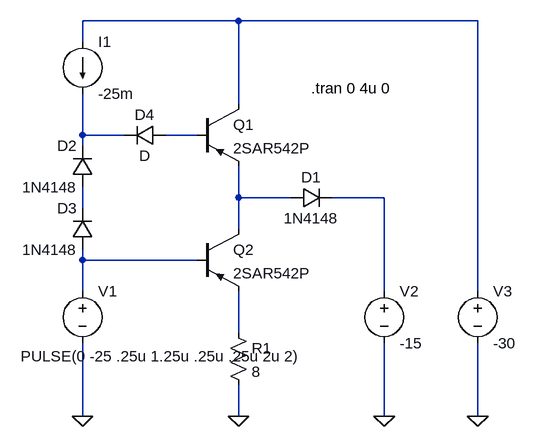
[diagram p0: schematic ClaseG_Basico_PNP.asc]
ClaseG_Basico_PNP.asc, the LTspice schematic file:
Version 4
SHEET 1 1020 680
WIRE 464 -48 224 -48
WIRE 832 -48 464 -48
WIRE 224 -16 224 -48
WIRE 464 80 464 -48
WIRE 224 128 224 64
WIRE 288 128 224 128
WIRE 400 128 352 128
WIRE 224 144 224 128
WIRE 464 224 464 176
WIRE 544 224 464 224
WIRE 688 224 608 224
WIRE 224 240 224 208
WIRE 464 272 464 224
WIRE 224 320 224 304
WIRE 400 320 224 320
WIRE 224 368 224 320
WIRE 688 368 688 224
WIRE 832 368 832 -48
WIRE 464 432 464 368
WIRE 224 560 224 448
WIRE 464 560 464 512
WIRE 688 560 688 448
WIRE 832 560 832 448
FLAG 464 560 0
FLAG 224 560 0
FLAG 688 560 0
FLAG 832 560 0
SYMBOL diode 544 240 R270
WINDOW 0 32 32 VTop 2
WINDOW 3 0 32 VBottom 2
SYMATTR InstName D1
SYMATTR Value 1N4148
SYMBOL voltage 224 352 R0
WINDOW 3 -95 116 Left 2
SYMATTR Value PULSE(0 -25 .25u 1.25u .25u .25u 2u 2)
SYMATTR InstName V1
SYMBOL voltage 688 352 R0
SYMATTR InstName V2
SYMATTR Value -15
SYMBOL voltage 832 352 R0
SYMATTR InstName V3
SYMATTR Value -30
SYMBOL res 448 416 R0
SYMATTR InstName R1
SYMATTR Value 8
SYMBOL current 224 -16 R0
SYMATTR InstName I1
SYMATTR Value -25m
SYMBOL diode 240 208 R180
WINDOW 0 24 64 Left 2
WINDOW 3 24 0 Left 2
SYMATTR InstName D2
SYMATTR Value 1N4148
SYMBOL diode 240 304 R180
WINDOW 0 24 64 Left 2
WINDOW 3 24 0 Left 2
SYMATTR InstName D3
SYMATTR Value 1N4148
SYMBOL diode 352 112 R90
WINDOW 0 0 32 VBottom 2
WINDOW 3 32 32 VTop 2
SYMATTR InstName D4
SYMBOL pnp 400 80 R0
SYMATTR InstName Q1
SYMATTR Value 2SAR542P
SYMBOL pnp 400 272 R0
SYMATTR InstName Q2
SYMATTR Value 2SAR542P
TEXT 576 56 Left 2 !.tran 0 4u 0

The netlist it stands for:
* ClaseG_Basico_PNP.asc
D1 N004 N005 1N4148
V1 N007 0 PULSE(0 -25 .25u 1.25u .25u .25u 2u 2)
V2 N005 0 -15
V3 N001 0 -30
R1 N008 0 8
I1 N001 N002 -25m
D2 N006 N002 1N4148
D3 N007 N006 1N4148
D4 N003 N002 D
Q1 N001 N003 N004 0 2SAR542P
Q2 N004 N007 N008 0 2SAR542P
.model D D
.lib standard.dio
.model NPN NPN
.model PNP PNP
.lib standard.bjt
.tran 0 4u 0
.backanno
.end